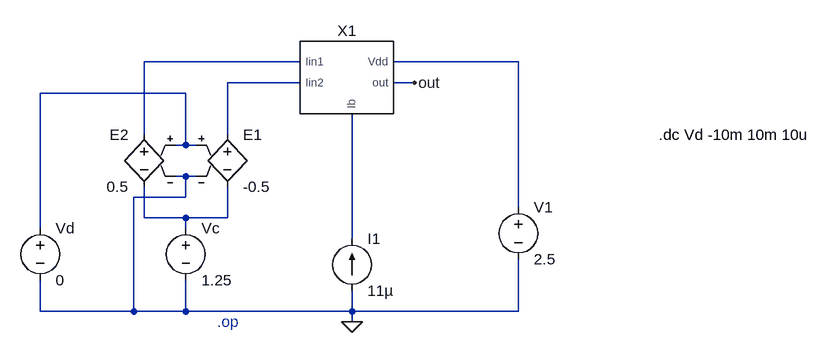
[diagram p0: schematic Folded_cascode_tb.asc]
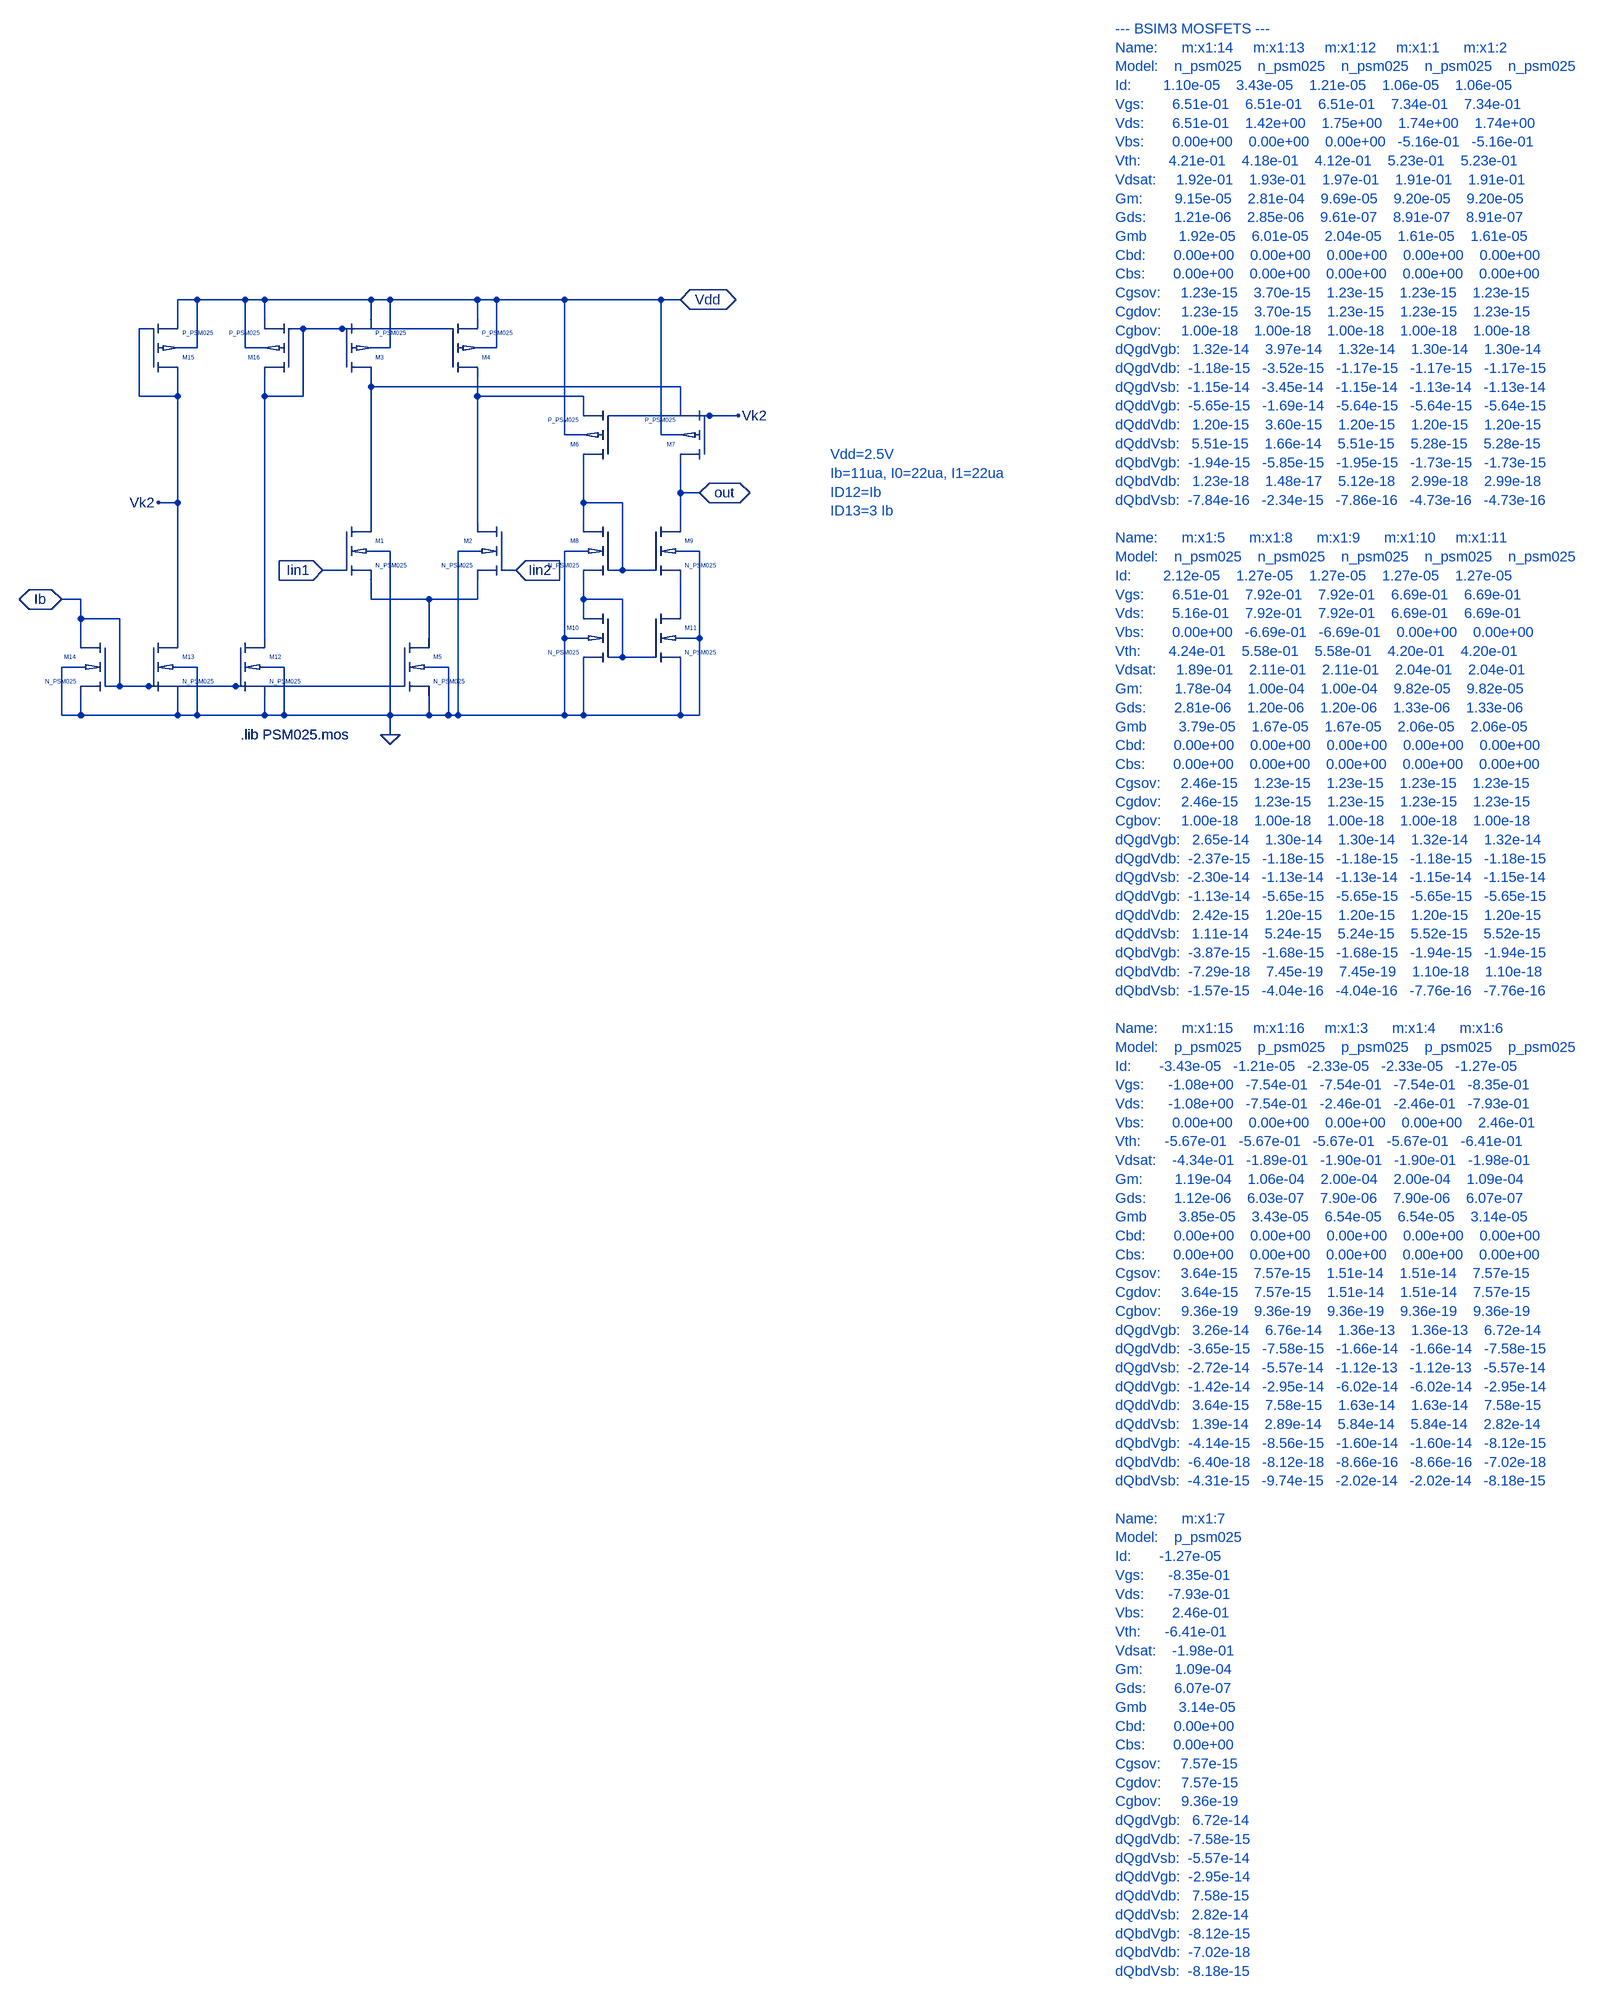
[diagram p1: sub-circuit folded_cascode.asc]
Folded_cascode_tb.asc, the LTspice schematic file:
Version 4
SHEET 1 916 680
WIRE 112 16 -128 16
WIRE 448 16 256 16
WIRE 112 48 0 48
WIRE 288 48 256 48
WIRE -64 64 -288 64
WIRE -128 128 -128 16
WIRE 0 128 0 48
WIRE -64 144 -64 64
WIRE -64 144 -80 144
WIRE -48 144 -64 144
WIRE -64 192 -80 192
WIRE -48 192 -64 192
WIRE -64 224 -64 192
WIRE -64 224 -144 224
WIRE 448 240 448 16
WIRE -128 256 -128 208
WIRE -64 256 -128 256
WIRE 0 256 0 208
WIRE 0 256 -64 256
WIRE -288 272 -288 64
WIRE -64 272 -64 256
WIRE 192 288 192 96
WIRE -288 400 -288 352
WIRE -144 400 -144 224
WIRE -144 400 -288 400
WIRE -64 400 -64 352
WIRE -64 400 -144 400
WIRE 192 400 192 368
WIRE 192 400 -64 400
WIRE 448 400 448 320
WIRE 448 400 192 400
WIRE 192 416 192 400
FLAG 192 416 0
FLAG 288 48 out
SYMBOL Folded_cascode 176 48 R0
SYMATTR InstName X1
SYMBOL current 192 368 M180
WINDOW 0 24 80 Left 2
WINDOW 3 24 0 Left 2
SYMATTR InstName I1
SYMATTR Value 11µ
SYMBOL voltage 448 224 R0
SYMATTR InstName V1
SYMATTR Value 2.5
SYMBOL voltage -288 256 R0
SYMATTR InstName Vd
SYMATTR Value 0
SYMBOL voltage -64 256 R0
WINDOW 123 0 0 Left 0
WINDOW 39 0 0 Left 0
SYMATTR InstName Vc
SYMATTR Value 1.25
SYMBOL e 0 112 R0
SYMATTR InstName E1
SYMATTR Value -0.5
SYMBOL e -128 112 M0
SYMATTR InstName E2
SYMATTR Value 0.5
TEXT -16 416 Left 2 ;.op
TEXT 664 128 Left 2 !.dc Vd -10m 10m 10u

folded_cascode.asc, the sub-circuit schematic file:
Version 4
SHEET 1 2556 2084
WIRE 208 -368 176 -368
WIRE 288 -368 208 -368
WIRE 320 -368 288 -368
WIRE 496 -368 320 -368
WIRE 528 -368 496 -368
WIRE 672 -368 528 -368
WIRE 704 -368 672 -368
WIRE 816 -368 704 -368
WIRE 976 -368 816 -368
WIRE 1008 -368 976 -368
WIRE 176 -336 176 -368
WIRE 320 -336 320 -368
WIRE 496 -336 496 -368
WIRE 672 -336 672 -368
WIRE 128 -320 112 -320
WIRE 384 -320 368 -320
WIRE 448 -320 384 -320
WIRE 624 -320 448 -320
WIRE 208 -288 208 -368
WIRE 208 -288 176 -288
WIRE 288 -288 288 -368
WIRE 320 -288 288 -288
WIRE 528 -288 528 -368
WIRE 528 -288 496 -288
WIRE 704 -288 704 -368
WIRE 704 -288 672 -288
WIRE 496 -224 496 -240
WIRE 1008 -224 496 -224
WIRE 112 -208 112 -320
WIRE 176 -208 176 -240
WIRE 176 -208 112 -208
WIRE 320 -208 320 -240
WIRE 384 -208 384 -320
WIRE 384 -208 320 -208
WIRE 672 -208 672 -240
WIRE 848 -208 672 -208
WIRE 848 -192 848 -208
WIRE 1008 -192 1008 -224
WIRE 1056 -176 896 -176
WIRE 1104 -176 1056 -176
WIRE 816 -144 816 -368
WIRE 848 -144 816 -144
WIRE 976 -144 976 -368
WIRE 1008 -144 976 -144
WIRE 1008 -48 1008 -96
WIRE 1040 -48 1008 -48
WIRE 176 -32 176 -208
WIRE 176 -32 144 -32
WIRE 848 -32 848 -96
WIRE 912 -32 848 -32
WIRE 496 0 496 -224
WIRE 672 0 672 -208
WIRE 848 0 848 -32
WIRE 1008 0 1008 -48
WIRE 528 48 496 48
WIRE 672 48 640 48
WIRE 848 48 816 48
WIRE 1040 48 1008 48
WIRE 448 80 416 80
WIRE 736 80 720 80
WIRE 912 80 912 -32
WIRE 912 80 896 80
WIRE 960 80 912 80
WIRE 16 128 -16 128
WIRE 496 128 496 96
WIRE 592 128 496 128
WIRE 672 128 672 96
WIRE 672 128 592 128
WIRE 848 128 848 96
WIRE 912 128 848 128
WIRE 848 144 848 128
WIRE 1008 144 1008 96
WIRE 16 160 16 128
WIRE 80 160 16 160
WIRE 16 192 16 160
WIRE 176 192 176 -32
WIRE 320 192 320 -208
WIRE 592 192 592 128
WIRE 816 192 816 48
WIRE 848 192 816 192
WIRE 1040 192 1040 48
WIRE 1040 192 1008 192
WIRE 912 224 912 128
WIRE 912 224 896 224
WIRE 960 224 912 224
WIRE 16 240 -16 240
WIRE 208 240 176 240
WIRE 352 240 320 240
WIRE 624 240 592 240
WIRE 80 272 80 160
WIRE 80 272 64 272
WIRE 128 272 80 272
WIRE 272 272 128 272
WIRE 544 272 272 272
WIRE -16 320 -16 240
WIRE 16 320 16 288
WIRE 16 320 -16 320
WIRE 176 320 176 288
WIRE 176 320 16 320
WIRE 208 320 208 240
WIRE 208 320 176 320
WIRE 320 320 320 288
WIRE 320 320 208 320
WIRE 352 320 352 240
WIRE 352 320 320 320
WIRE 528 320 528 48
WIRE 528 320 352 320
WIRE 592 320 592 288
WIRE 592 320 528 320
WIRE 624 320 624 240
WIRE 624 320 592 320
WIRE 640 320 640 48
WIRE 640 320 624 320
WIRE 816 320 816 192
WIRE 816 320 640 320
WIRE 848 320 848 240
WIRE 848 320 816 320
WIRE 1008 320 1008 240
WIRE 1008 320 848 320
WIRE 1040 320 1040 192
WIRE 1040 320 1008 320
WIRE 528 352 528 320
FLAG 528 352 0
FLAG 144 -32 Vk2
FLAG 1104 -176 Vk2
FLAG -16 128 Ib
IOPIN -16 128 BiDir
FLAG 416 80 Iin1
IOPIN 416 80 In
FLAG 736 80 Iin2
IOPIN 736 80 In
FLAG 1008 -368 Vdd
IOPIN 1008 -368 BiDir
FLAG 1040 -48 out
IOPIN 1040 -48 BiDir
SYMBOL N_PSM025 64 192 M0
SYMATTR InstName M14
SYMATTR Value2 l=1u w=2.15u
SYMBOL P_PSM025 128 -240 M180
SYMATTR InstName M15
SYMATTR Value2 l=1u w=5.5u
SYMBOL N_PSM025 128 192 R0
SYMATTR InstName M13
SYMATTR Value2 l=1u w=6.45u
SYMBOL N_PSM025 272 192 R0
SYMATTR InstName M12
SYMATTR Value2 l=1u w=2.15u
SYMBOL P_PSM025 368 -240 R180
SYMATTR InstName M16
SYMATTR Value2 l=1u w=11.45u
SYMBOL P_PSM025 448 -240 M180
SYMATTR InstName M3
SYMATTR Value2 l=1u w=22.9u
SYMBOL P_PSM025 624 -240 M180
SYMATTR InstName M4
SYMATTR Value2 l=1u w=22.9u
SYMBOL N_PSM025 448 0 R0
SYMATTR InstName M1
SYMATTR Value2 l=1u w=2.15u
SYMBOL N_PSM025 720 0 M0
SYMATTR InstName M2
SYMATTR Value2 l=1u w=2.15u
SYMBOL N_PSM025 544 192 R0
SYMATTR InstName M5
SYMATTR Value2 l=1u w=4.3u
SYMBOL P_PSM025 896 -96 R180
SYMATTR InstName M6
SYMATTR Value2 l=1u w=11.45u
SYMBOL P_PSM025 1056 -96 R180
SYMATTR InstName M7
SYMATTR Value2 l=1u w=11.45u
SYMBOL N_PSM025 896 0 M0
SYMATTR InstName M8
SYMATTR Value2 l=1u w=2.15u
SYMBOL N_PSM025 960 0 R0
SYMATTR InstName M9
SYMATTR Value2 l=1u w=2.15u
SYMBOL N_PSM025 896 144 M0
SYMATTR InstName M10
SYMATTR Value2 l=1u w=2.15u
SYMBOL N_PSM025 960 144 R0
SYMATTR InstName M11
SYMATTR Value2 l=1u w=2.15u
TEXT 1256 -112 Left 2 ;Vdd=2.5V\nIb=11ua, I0=22ua, I1=22ua\nID12=Ib\nID13=3 Ib
TEXT 1728 -816 Left 2 ;--- BSIM3 MOSFETS ---\nName:      m:x1:14     m:x1:13     m:x1:12     m:x1:1      m:x1:2\nModel:    n_psm025    n_psm025    n_psm025    n_psm025    n_psm025\nId:        1.10e-05    3.43e-05    1.21e-05    1.06e-05    1.06e-05\nVgs:       6.51e-01    6.51e-01    6.51e-01    7.34e-01    7.34e-01\nVds:       6.51e-01    1.42e+00    1.75e+00    1.74e+00    1.74e+00\nVbs:       0.00e+00    0.00e+00    0.00e+00   -5.16e-01   -5.16e-01\nVth:       4.21e-01    4.18e-01    4.12e-01    5.23e-01    5.23e-01\nVdsat:     1.92e-01    1.93e-01    1.97e-01    1.91e-01    1.91e-01\nGm:        9.15e-05    2.81e-04    9.69e-05    9.20e-05    9.20e-05\nGds:       1.21e-06    2.85e-06    9.61e-07    8.91e-07    8.91e-07\nGmb        1.92e-05    6.01e-05    2.04e-05    1.61e-05    1.61e-05\nCbd:       0.00e+00    0.00e+00    0.00e+00    0.00e+00    0.00e+00\nCbs:       0.00e+00    0.00e+00    0.00e+00    0.00e+00    0.00e+00\nCgsov:     1.23e-15    3.70e-15    1.23e-15    1.23e-15    1.23e-15\nCgdov:     1.23e-15    3.70e-15    1.23e-15    1.23e-15    1.23e-15\nCgbov:     1.00e-18    1.00e-18    1.00e-18    1.00e-18    1.00e-18\ndQgdVgb:   1.32e-14    3.97e-14    1.32e-14    1.30e-14    1.30e-14\ndQgdVdb:  -1.18e-15   -3.52e-15   -1.17e-15   -1.17e-15   -1.17e-15\ndQgdVsb:  -1.15e-14   -3.45e-14   -1.15e-14   -1.13e-14   -1.13e-14\ndQddVgb:  -5.65e-15   -1.69e-14   -5.64e-15   -5.64e-15   -5.64e-15\ndQddVdb:   1.20e-15    3.60e-15    1.20e-15    1.20e-15    1.20e-15\ndQddVsb:   5.51e-15    1.66e-14    5.51e-15    5.28e-15    5.28e-15\ndQbdVgb:  -1.94e-15   -5.85e-15   -1.95e-15   -1.73e-15   -1.73e-15\ndQbdVdb:   1.23e-18    1.48e-17    5.12e-18    2.99e-18    2.99e-18\ndQbdVsb:  -7.84e-16   -2.34e-15   -7.86e-16   -4.73e-16   -4.73e-16\n \nName:      m:x1:5      m:x1:8      m:x1:9      m:x1:10     m:x1:11\nModel:    n_psm025    n_psm025    n_psm025    n_psm025    n_psm025\nId:        2.12e-05    1.27e-05    1.27e-05    1.27e-05    1.27e-05\nVgs:       6.51e-01    7.92e-01    7.92e-01    6.69e-01    6.69e-01\nVds:       5.16e-01    7.92e-01    7.92e-01    6.69e-01    6.69e-01\nVbs:       0.00e+00   -6.69e-01   -6.69e-01    0.00e+00    0.00e+00\nVth:       4.24e-01    5.58e-01    5.58e-01    4.20e-01    4.20e-01\nVdsat:     1.89e-01    2.11e-01    2.11e-01    2.04e-01    2.04e-01\nGm:        1.78e-04    1.00e-04    1.00e-04    9.82e-05    9.82e-05\nGds:       2.81e-06    1.20e-06    1.20e-06    1.33e-06    1.33e-06\nGmb        3.79e-05    1.67e-05    1.67e-05    2.06e-05    2.06e-05\nCbd:       0.00e+00    0.00e+00    0.00e+00    0.00e+00    0.00e+00\nCbs:       0.00e+00    0.00e+00    0.00e+00    0.00e+00    0.00e+00\nCgsov:     2.46e-15    1.23e-15    1.23e-15    1.23e-15    1.23e-15\nCgdov:     2.46e-15    1.23e-15    1.23e-15    1.23e-15    1.23e-15\nCgbov:     1.00e-18    1.00e-18    1.00e-18    1.00e-18    1.00e-18\ndQgdVgb:   2.65e-14    1.30e-14    1.30e-14    1.32e-14    1.32e-14\ndQgdVdb:  -2.37e-15   -1.18e-15   -1.18e-15   -1.18e-15   -1.18e-15\ndQgdVsb:  -2.30e-14   -1.13e-14   -1.13e-14   -1.15e-14   -1.15e-14\ndQddVgb:  -1.13e-14   -5.65e-15   -5.65e-15   -5.65e-15   -5.65e-15\ndQddVdb:   2.42e-15    1.20e-15    1.20e-15    1.20e-15    1.20e-15\ndQddVsb:   1.11e-14    5.24e-15    5.24e-15    5.52e-15    5.52e-15\ndQbdVgb:  -3.87e-15   -1.68e-15   -1.68e-15   -1.94e-15   -1.94e-15\ndQbdVdb:  -7.29e-18    7.45e-19    7.45e-19    1.10e-18    1.10e-18\ndQbdVsb:  -1.57e-15   -4.04e-16   -4.04e-16   -7.76e-16   -7.76e-16\n \nName:      m:x1:15     m:x1:16     m:x1:3      m:x1:4      m:x1:6\nModel:    p_psm025    p_psm025    p_psm025    p_psm025    p_psm025\nId:       -3.43e-05   -1.21e-05   -2.33e-05   -2.33e-05   -1.27e-05\nVgs:      -1.08e+00   -7.54e-01   -7.54e-01   -7.54e-01   -8.35e-01\nVds:      -1.08e+00   -7.54e-01   -2.46e-01   -2.46e-01   -7.93e-01\nVbs:       0.00e+00    0.00e+00    0.00e+00    0.00e+00    2.46e-01\nVth:      -5.67e-01   -5.67e-01   -5.67e-01   -5.67e-01   -6.41e-01\nVdsat:    -4.34e-01   -1.89e-01   -1.90e-01   -1.90e-01   -1.98e-01\nGm:        1.19e-04    1.06e-04    2.00e-04    2.00e-04    1.09e-04\nGds:       1.12e-06    6.03e-07    7.90e-06    7.90e-06    6.07e-07\nGmb        3.85e-05    3.43e-05    6.54e-05    6.54e-05    3.14e-05\nCbd:       0.00e+00    0.00e+00    0.00e+00    0.00e+00    0.00e+00\nCbs:       0.00e+00    0.00e+00    0.00e+00    0.00e+00    0.00e+00\nCgsov:     3.64e-15    7.57e-15    1.51e-14    1.51e-14    7.57e-15\nCgdov:     3.64e-15    7.57e-15    1.51e-14    1.51e-14    7.57e-15\nCgbov:     9.36e-19    9.36e-19    9.36e-19    9.36e-19    9.36e-19\ndQgdVgb:   3.26e-14    6.76e-14    1.36e-13    1.36e-13    6.72e-14\ndQgdVdb:  -3.65e-15   -7.58e-15   -1.66e-14   -1.66e-14   -7.58e-15\ndQgdVsb:  -2.72e-14   -5.57e-14   -1.12e-13   -1.12e-13   -5.57e-14\ndQddVgb:  -1.42e-14   -2.95e-14   -6.02e-14   -6.02e-14   -2.95e-14\ndQddVdb:   3.64e-15    7.58e-15    1.63e-14    1.63e-14    7.58e-15\ndQddVsb:   1.39e-14    2.89e-14    5.84e-14    5.84e-14    2.82e-14\ndQbdVgb:  -4.14e-15   -8.56e-15   -1.60e-14   -1.60e-14   -8.12e-15\ndQbdVdb:  -6.40e-18   -8.12e-18   -8.66e-16   -8.66e-16   -7.02e-18\ndQbdVsb:  -4.31e-15   -9.74e-15   -2.02e-14   -2.02e-14   -8.18e-15\n \nName:      m:x1:7\nModel:    p_psm025\nId:       -1.27e-05\nVgs:      -8.35e-01\nVds:      -7.93e-01\nVbs:       2.46e-01\nVth:      -6.41e-01\nVdsat:    -1.98e-01\nGm:        1.09e-04\nGds:       6.07e-07\nGmb        3.14e-05\nCbd:       0.00e+00\nCbs:       0.00e+00\nCgsov:     7.57e-15\nCgdov:     7.57e-15\nCgbov:     9.36e-19\ndQgdVgb:   6.72e-14\ndQgdVdb:  -7.58e-15\ndQgdVsb:  -5.57e-14\ndQddVgb:  -2.95e-14\ndQddVdb:   7.58e-15\ndQddVsb:   2.82e-14\ndQbdVgb:  -8.12e-15\ndQbdVdb:  -7.02e-18\ndQbdVsb:  -8.18e-15
TEXT 280 352 Left 2 !.lib PSM025.mos

The netlist it stands for:
* Folded_cascode_tb.asc
XX1 N001 N003 N006 out N002 folded_cascode
I1 0 N006 11µ
V1 N002 0 2.5
Vd N004 0 0
Vc N005 0 1.25
E1 N003 N005 N004 0 -0.5
E2 N001 N005 N004 0 0.5

* block symbol definitions
.subckt folded_cascode Iin1 Iin2 Ib out Vdd
M14 Ib Ib 0 0 N_PSM025 l=1u w=2.15u
M15 Vk2 Vk2 Vdd Vdd P_PSM025 l=1u w=5.5u
M13 Vk2 Ib 0 0 N_PSM025 l=1u w=6.45u
M12 N001 Ib 0 0 N_PSM025 l=1u w=2.15u
M16 N001 N001 Vdd Vdd P_PSM025 l=1u w=11.45u
M3 N002 N001 Vdd Vdd P_PSM025 l=1u w=22.9u
M4 N003 N001 Vdd Vdd P_PSM025 l=1u w=22.9u
M1 N002 Iin1 N005 0 N_PSM025 l=1u w=2.15u
M2 N003 Iin2 N005 0 N_PSM025 l=1u w=2.15u
M5 N005 Ib 0 0 N_PSM025 l=1u w=4.3u
M6 N004 Vk2 N003 Vdd P_PSM025 l=1u w=11.45u
M7 out Vk2 N002 Vdd P_PSM025 l=1u w=11.45u
M8 N004 N004 N006 0 N_PSM025 l=1u w=2.15u
M9 out N004 N007 0 N_PSM025 l=1u w=2.15u
M10 N006 N006 0 0 N_PSM025 l=1u w=2.15u
M11 N007 N006 0 0 N_PSM025 l=1u w=2.15u
* Vdd=2.5V
* Ib=11ua, I0=22ua, I1=22ua
* ID12=Ib
* ID13=3 Ib
* --- BSIM3 MOSFETS ---
* Name:      m:x1:14     m:x1:13     m:x1:12     m:x1:1      m:x1:2
* Model:    n_psm025    n_psm025    n_psm025    n_psm025    n_psm025
* Id:        1.10e-05    3.43e-05    1.21e-05    1.06e-05    1.06e-05
* Vgs:       6.51e-01    6.51e-01    6.51e-01    7.34e-01    7.34e-01
* Vds:       6.51e-01    1.42e+00    1.75e+00    1.74e+00    1.74e+00
* Vbs:       0.00e+00    0.00e+00    0.00e+00   -5.16e-01   -5.16e-01
* Vth:       4.21e-01    4.18e-01    4.12e-01    5.23e-01    5.23e-01
* Vdsat:     1.92e-01    1.93e-01    1.97e-01    1.91e-01    1.91e-01
* Gm:        9.15e-05    2.81e-04    9.69e-05    9.20e-05    9.20e-05
* Gds:       1.21e-06    2.85e-06    9.61e-07    8.91e-07    8.91e-07
* Gmb        1.92e-05    6.01e-05    2.04e-05    1.61e-05    1.61e-05
* Cbd:       0.00e+00    0.00e+00    0.00e+00    0.00e+00    0.00e+00
* Cbs:       0.00e+00    0.00e+00    0.00e+00    0.00e+00    0.00e+00
* Cgsov:     1.23e-15    3.70e-15    1.23e-15    1.23e-15    1.23e-15
* Cgdov:     1.23e-15    3.70e-15    1.23e-15    1.23e-15    1.23e-15
* Cgbov:     1.00e-18    1.00e-18    1.00e-18    1.00e-18    1.00e-18
* dQgdVgb:   1.32e-14    3.97e-14    1.32e-14    1.30e-14    1.30e-14
* dQgdVdb:  -1.18e-15   -3.52e-15   -1.17e-15   -1.17e-15   -1.17e-15
* dQgdVsb:  -1.15e-14   -3.45e-14   -1.15e-14   -1.13e-14   -1.13e-14
* dQddVgb:  -5.65e-15   -1.69e-14   -5.64e-15   -5.64e-15   -5.64e-15
* dQddVdb:   1.20e-15    3.60e-15    1.20e-15    1.20e-15    1.20e-15
* dQddVsb:   5.51e-15    1.66e-14    5.51e-15    5.28e-15    5.28e-15
* dQbdVgb:  -1.94e-15   -5.85e-15   -1.95e-15   -1.73e-15   -1.73e-15
* dQbdVdb:   1.23e-18    1.48e-17    5.12e-18    2.99e-18    2.99e-18
* dQbdVsb:  -7.84e-16   -2.34e-15   -7.86e-16   -4.73e-16   -4.73e-16
* Name:      m:x1:5      m:x1:8      m:x1:9      m:x1:10     m:x1:11
* Model:    n_psm025    n_psm025    n_psm025    n_psm025    n_psm025
* Id:        2.12e-05    1.27e-05    1.27e-05    1.27e-05    1.27e-05
* Vgs:       6.51e-01    7.92e-01    7.92e-01    6.69e-01    6.69e-01
* Vds:       5.16e-01    7.92e-01    7.92e-01    6.69e-01    6.69e-01
* Vbs:       0.00e+00   -6.69e-01   -6.69e-01    0.00e+00    0.00e+00
* Vth:       4.24e-01    5.58e-01    5.58e-01    4.20e-01    4.20e-01
* Vdsat:     1.89e-01    2.11e-01    2.11e-01    2.04e-01    2.04e-01
* Gm:        1.78e-04    1.00e-04    1.00e-04    9.82e-05    9.82e-05
* Gds:       2.81e-06    1.20e-06    1.20e-06    1.33e-06    1.33e-06
* Gmb        3.79e-05    1.67e-05    1.67e-05    2.06e-05    2.06e-05
* Cbd:       0.00e+00    0.00e+00    0.00e+00    0.00e+00    0.00e+00
* Cbs:       0.00e+00    0.00e+00    0.00e+00    0.00e+00    0.00e+00
* Cgsov:     2.46e-15    1.23e-15    1.23e-15    1.23e-15    1.23e-15
* Cgdov:     2.46e-15    1.23e-15    1.23e-15    1.23e-15    1.23e-15
* Cgbov:     1.00e-18    1.00e-18    1.00e-18    1.00e-18    1.00e-18
* dQgdVgb:   2.65e-14    1.30e-14    1.30e-14    1.32e-14    1.32e-14
* dQgdVdb:  -2.37e-15   -1.18e-15   -1.18e-15   -1.18e-15   -1.18e-15
* dQgdVsb:  -2.30e-14   -1.13e-14   -1.13e-14   -1.15e-14   -1.15e-14
* dQddVgb:  -1.13e-14   -5.65e-15   -5.65e-15   -5.65e-15   -5.65e-15
* dQddVdb:   2.42e-15    1.20e-15    1.20e-15    1.20e-15    1.20e-15
* dQddVsb:   1.11e-14    5.24e-15    5.24e-15    5.52e-15    5.52e-15
* dQbdVgb:  -3.87e-15   -1.68e-15   -1.68e-15   -1.94e-15   -1.94e-15
* dQbdVdb:  -7.29e-18    7.45e-19    7.45e-19    1.10e-18    1.10e-18
* dQbdVsb:  -1.57e-15   -4.04e-16   -4.04e-16   -7.76e-16   -7.76e-16
* Name:      m:x1:15     m:x1:16     m:x1:3      m:x1:4      m:x1:6
* Model:    p_psm025    p_psm025    p_psm025    p_psm025    p_psm025
* Id:       -3.43e-05   -1.21e-05   -2.33e-05   -2.33e-05   -1.27e-05
* Vgs:      -1.08e+00   -7.54e-01   -7.54e-01   -7.54e-01   -8.35e-01
* Vds:      -1.08e+00   -7.54e-01   -2.46e-01   -2.46e-01   -7.93e-01
* Vbs:       0.00e+00    0.00e+00    0.00e+00    0.00e+00    2.46e-01
* Vth:      -5.67e-01   -5.67e-01   -5.67e-01   -5.67e-01   -6.41e-01
* Vdsat:    -4.34e-01   -1.89e-01   -1.90e-01   -1.90e-01   -1.98e-01
* Gm:        1.19e-04    1.06e-04    2.00e-04    2.00e-04    1.09e-04
* Gds:       1.12e-06    6.03e-07    7.90e-06    7.90e-06    6.07e-07
* Gmb        3.85e-05    3.43e-05    6.54e-05    6.54e-05    3.14e-05
* Cbd:       0.00e+00    0.00e+00    0.00e+00    0.00e+00    0.00e+00
* Cbs:       0.00e+00    0.00e+00    0.00e+00    0.00e+00    0.00e+00
* Cgsov:     3.64e-15    7.57e-15    1.51e-14    1.51e-14    7.57e-15
* Cgdov:     3.64e-15    7.57e-15    1.51e-14    1.51e-14    7.57e-15
* Cgbov:     9.36e-19    9.36e-19    9.36e-19    9.36e-19    9.36e-19
* dQgdVgb:   3.26e-14    6.76e-14    1.36e-13    1.36e-13    6.72e-14
* dQgdVdb:  -3.65e-15   -7.58e-15   -1.66e-14   -1.66e-14   -7.58e-15
* dQgdVsb:  -2.72e-14   -5.57e-14   -1.12e-13   -1.12e-13   -5.57e-14
* dQddVgb:  -1.42e-14   -2.95e-14   -6.02e-14   -6.02e-14   -2.95e-14
* dQddVdb:   3.64e-15    7.58e-15    1.63e-14    1.63e-14    7.58e-15
* dQddVsb:   1.39e-14    2.89e-14    5.84e-14    5.84e-14    2.82e-14
* dQbdVgb:  -4.14e-15   -8.56e-15   -1.60e-14   -1.60e-14   -8.12e-15
* dQbdVdb:  -6.40e-18   -8.12e-18   -8.66e-16   -8.66e-16   -7.02e-18
* dQbdVsb:  -4.31e-15   -9.74e-15   -2.02e-14   -2.02e-14   -8.18e-15
* Name:      m:x1:7
* Model:    p_psm025
* Id:       -1.27e-05
* Vgs:      -8.35e-01
* Vds:      -7.93e-01
* Vbs:       2.46e-01
* Vth:      -6.41e-01
* Vdsat:    -1.98e-01
* Gm:        1.09e-04
* Gds:       6.07e-07
* Gmb        3.14e-05
* Cbd:       0.00e+00
* Cbs:       0.00e+00
* Cgsov:     7.57e-15
* Cgdov:     7.57e-15
* Cgbov:     9.36e-19
* dQgdVgb:   6.72e-14
* dQgdVdb:  -7.58e-15
* dQgdVsb:  -5.57e-14
* dQddVgb:  -2.95e-14
* dQddVdb:   7.58e-15
* dQddVsb:   2.82e-14
* dQbdVgb:  -8.12e-15
* dQbdVdb:  -7.02e-18
* dQbdVsb:  -8.18e-15
.lib PSM025.mos
.ends folded_cascode

.model NMOS NMOS
.model PMOS PMOS
.lib standard.mos
* .op
.dc Vd -10m 10m 10u
.lib PSM025.mos
.backanno
.end